# EasyEDA Pro project SimGEKI2_Core.epro, board Core New
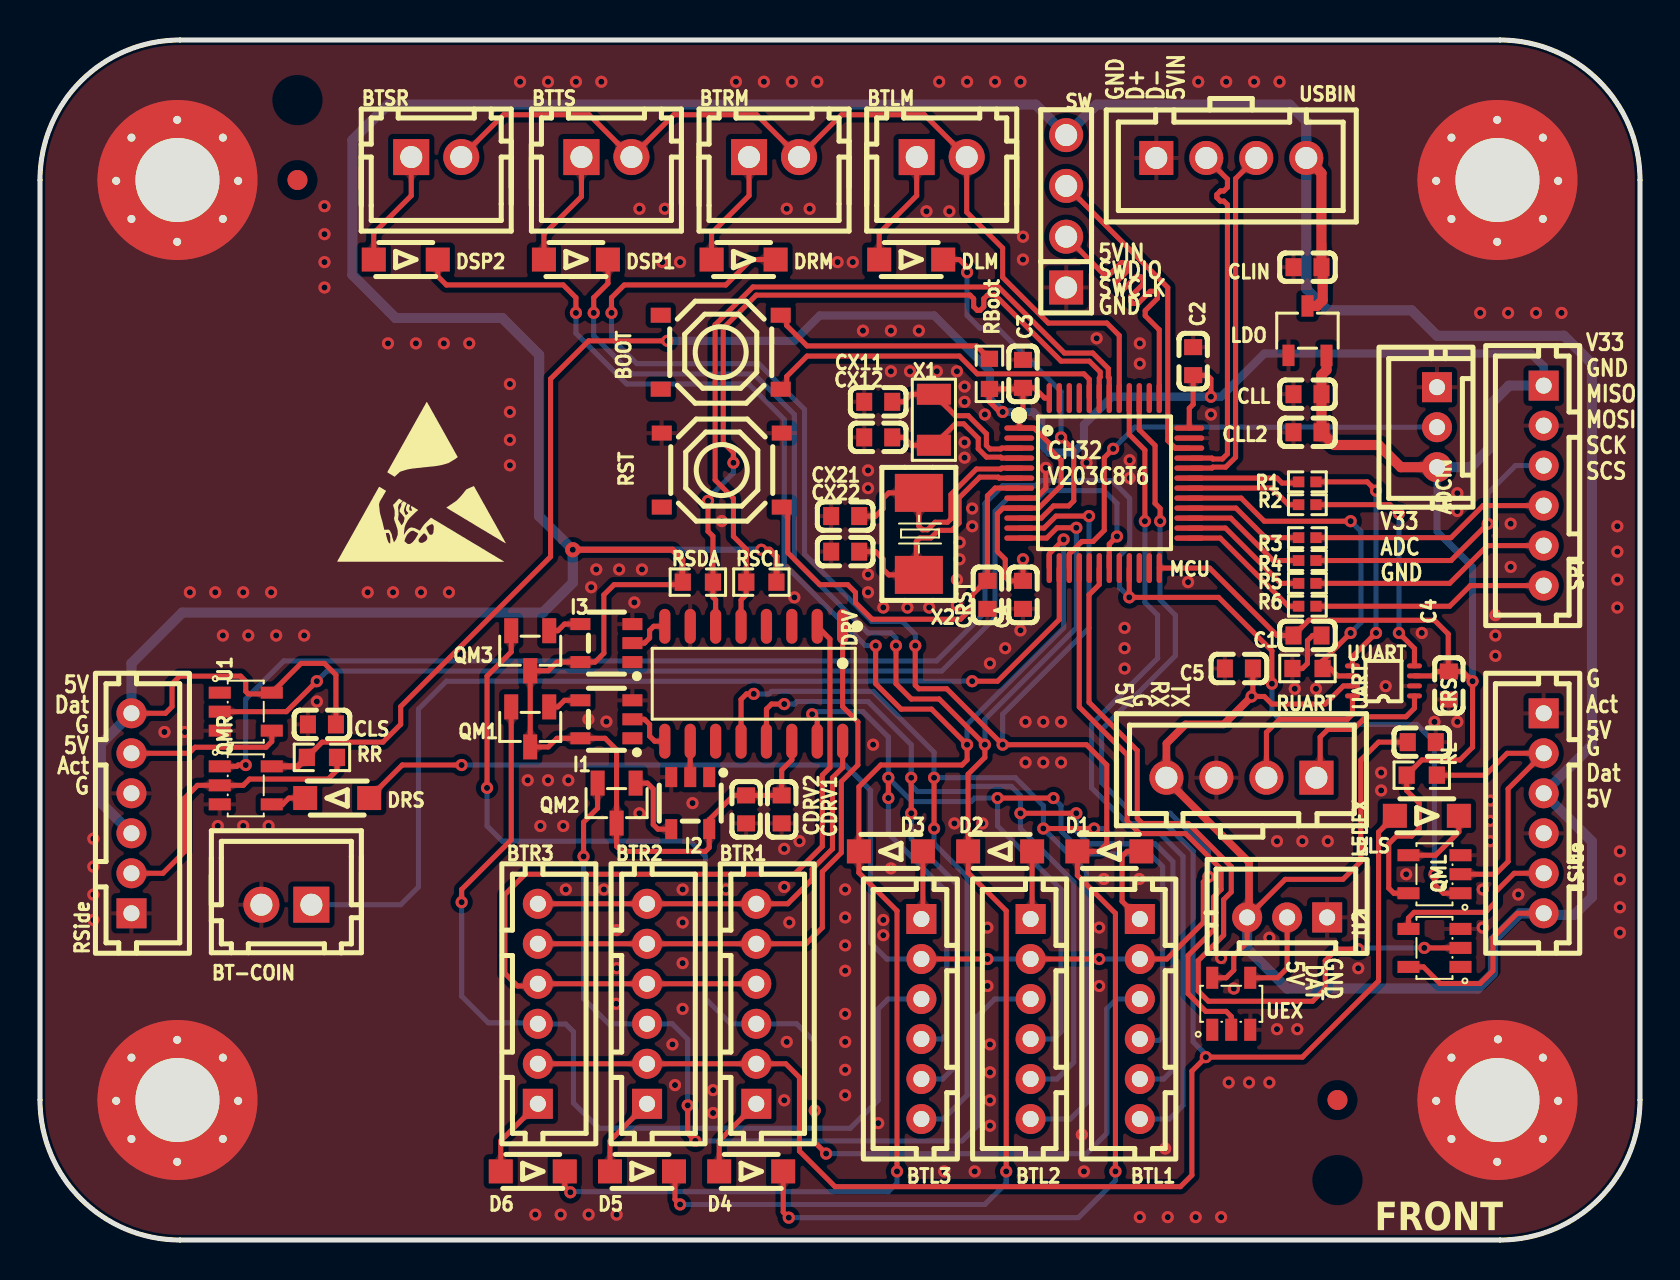
[diagram p1: board, top side]
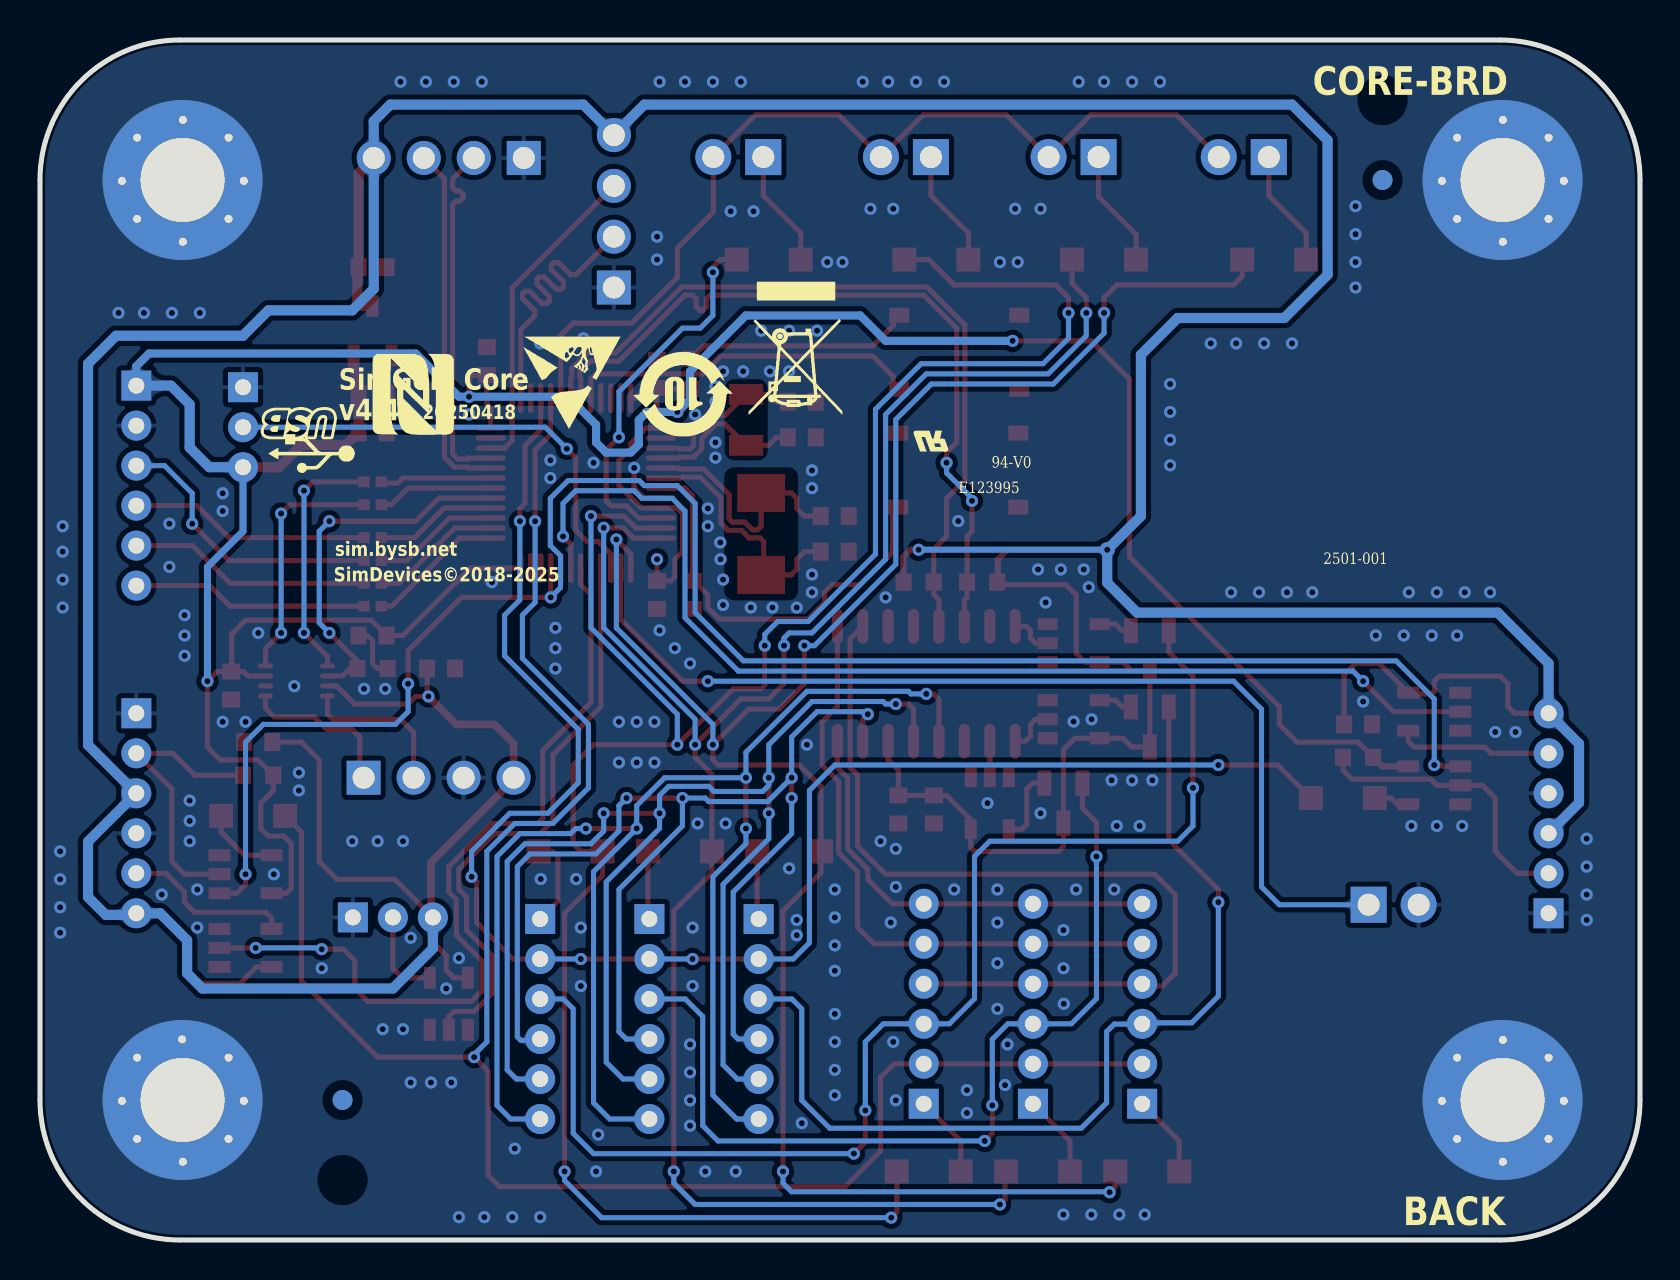
[diagram p2: board, bottom side, seen from below]

Outline 80 x 60 mm; copper layers: Top Layer, Bottom Layer. Coordinates in mm from the lower left corner of the outline.
Outline path: 0,53 0,7 arc(2.05,2.05) 7,0 73,0 arc(77.95,2.05) 80,7 80,53 arc(77.95,57.95) 73,60 7,60 arc(2.05,57.95) 0,53
Stack: Top Layer 0.035mm / Dielectric1 1.51mm FR4 er 4.5 / Bottom Layer 0.035mm

## Design rules (mm)
net D-: DP2
net D+: DP2
net SCL: DP5
net SDA: DP5
net OSC32_IN: DP1
net OSC32_OUT: DP1
net OSC_IN: DP4
net OSC_OUT: DP4
net SWDIO: DP3
net SWCLK: DP3
template: JLCPCB Capability(Two Layers Board)
spacing copperThickness1oz (default): track to track 0.102, other pairs 0.152 to 0.3
spacing copperThickness2oz: track to track 0.203, other pairs 0.152 to 0.3
track width copperThickness1oz (default): min 0.127, default 0.254, max 2.54
track width copperThickness2oz: min 0.203, default 0.254, max 2.54
differential pair differentialPair (default): width min 0.127, default 0.254, max 2.54; gap min 0.152, default 0.152
via viaSize (default): diameter min 0.5, default 0.61, max 10; hole min 0.3, default 0.305, max 6.3

## Placement (name value [footprint] x y rotation side)
ADCIN  HDGC2001WV-3P  [CONN-TH_3P-P2.00_HDGC2001WV-3P]  69.85 40.64 270 top
BOOT  TS-1187A-B-A-B  [SW-SMD_4P-L5.1-W5.1-P3.70-LS6.5-TL_H1.5]  34.04 44.39 180 top
BT-COIN  ZX-XH2.54-2PZZ  [CONN-TH_2P-P2.50_HX25003-2A]  12.32 16.76 180 top
BTL1  HDGC2001WV-6P  [CONN-TH_6P-P2.00_HDGC2001WV-6P]  54.99 11.05 270 top
BTL2  HDGC2001WV-6P  [CONN-TH_6P-P2.00_HDGC2001WV-6P]  49.53 11.05 270 top
BTL3  HDGC2001WV-6P  [CONN-TH_6P-P2.00_HDGC2001WV-6P]  44.07 11.05 270 top
BTLM  ZX-XH2.54-2PZZ  [CONN-TH_2P-P2.50_HX25003-2A]  45.09 54.15 0 top
BTR1  HDGC2001WV-6P  [CONN-TH_6P-P2.00_HDGC2001WV-6P]  35.81 11.81 90 top
BTR2  HDGC2001WV-6P  [CONN-TH_6P-P2.00_HDGC2001WV-6P]  30.35 11.81 90 top
BTR3  HDGC2001WV-6P  [CONN-TH_6P-P2.00_HDGC2001WV-6P]  24.89 11.81 90 top
BTRM  ZX-XH2.54-2PZZ  [CONN-TH_2P-P2.50_HX25003-2A]  36.7 54.15 0 top
BTSR  ZX-XH2.54-2PZZ  [CONN-TH_2P-P2.50_HX25003-2A]  19.81 54.15 0 top
BTTS  ZX-XH2.54-2PZZ  [CONN-TH_2P-P2.50_HX25003-2A]  28.32 54.15 0 top
C1  100nF  [C0603]  63.37 30.23 0 top
C2  100nF  [C0603]  57.66 43.94 90 top
C3  100nF  [C0603]  49.15 43.31 90 top
C4  100nF  [C0603]  70.44 27.72 270 top
C5  100nF  [C0603]  59.94 28.58 180 top
CA  100nF  [C0603]  49.15 32.26 90 top
CDRV1  2.2uF  [C0603]  37.08 21.53 270 top
CDRV2  100nF  [C0603]  35.31 21.53 270 top
CLIN  1uF  [C0603]  63.37 48.64 0 top
CLL  1uF  [C0603]  63.37 42.29 180 top
CLL2  100nF  [C0603]  63.37 40.39 180 top
CLS  100nF  [C0603]  14.1 25.78 180 top
CRS  100nF  [C0603]  69.09 24.89 0 top
CRST  100nF  [C0603]  47.37 32.26 90 top
CX11  15pF  [C0603]  41.91 41.91 0 top
CX12  15pF  [C0603]  41.91 40.13 0 top
CX21  22pF  [C0603]  40.26 36.2 0 top
CX22  22pF  [C0603]  40.26 34.42 0 top
D1  1N4148W  [SOD-123FL_L2.8-W1.8-LS3.7-RD_CC1884540]  53.47 19.43 0 top
D2  1N4148W  [SOD-123FL_L2.8-W1.8-LS3.7-RD_CC1884540]  48.01 19.43 0 top
D3  1N4148W  [SOD-123FL_L2.8-W1.8-LS3.7-RD_CC1884540]  42.54 19.43 0 top
D4  1N4148W  [SOD-123FL_L2.8-W1.8-LS3.7-RD_CC1884540]  35.56 3.43 180 top
D5  1N4148W  [SOD-123FL_L2.8-W1.8-LS3.7-RD_CC1884540]  30.1 3.43 180 top
D6  1N4148W  [SOD-123FL_L2.8-W1.8-LS3.7-RD_CC1884540]  24.64 3.43 180 top
DLM  1N4148W  [SOD-123FL_L2.8-W1.8-LS3.7-RD_CC1884540]  43.56 49.02 180 top
DLS  1N4148W  [SOD-123FL_L2.8-W1.8-LS3.7-RD_CC1884540]  69.34 21.21 180 top
DRM  1N4148W  [SOD-123FL_L2.8-W1.8-LS3.7-RD_CC1884540]  35.18 49.02 180 top
DRS  1N4148W  [SOD-123FL_L2.8-W1.8-LS3.7-RD_CC1884540]  14.86 22.1 0 top
DRV  CH422G  [SOP-16_L10.0-W3.9-P1.27-LS6.0-BL]  35.69 27.81 180 top
DSP1  1N4148W  [SOD-123FL_L2.8-W1.8-LS3.7-RD_CC1884540]  26.8 49.02 180 top
DSP2  1N4148W  [SOD-123FL_L2.8-W1.8-LS3.7-RD_CC1884540]  18.29 49.02 180 top
I1  SN74LVC1G14DBVR  [SOT-23-5_L3.0-W1.7-P0.95-LS2.8-BR]  28.32 26.03 0 top
I2  SN74LVC1G14DBVR  [SOT-23-5_L3.0-W1.7-P0.95-LS2.8-BR]  32.51 21.84 90 top
I3  SN74LVC1G14DBVR  [SOT-23-5_L3.0-W1.7-P0.95-LS2.8-BR]  28.32 29.84 0 top
LDO  XC6206P332MR-G  [SOT-23-3_L2.9-W1.6-P1.90-LS2.8-BR]  63.37 45.47 270 top
LEDEX  HDGC2001WV-3P  [CONN-TH_3P-P2.00_HDGC2001WV-3P]  62.36 16.13 180 top
LSide  HDGC2001WV-6P  [CONN-TH_6P-P2.00_HDGC2001WV-6P]  75.18 21.34 270 top
MCU  CH32V203C8T6  [LQFP-48_L7.0-W7.0-P0.50-LS9.0-BL]  53.21 37.85 270 top
NOREF  -  [Pad_e3311]  75.14 9.12 0 top
NOREF#2  -  [Pad_e3320]  72.86 56.01 0 top
NOREF#3  -  [Pad_e3309]  75.14 5.05 0 top
NOREF#4  -  [Pad_e3290]  9.14 55.12 0 top
NOREF#5  -  [Pad_e3306]  69.81 6.96 0 top
NOREF#6  -  [Pad_e3295]  3.81 52.96 0 top
NOREF#7  -  [Pad_e3294]  4.57 51.05 0 top
NOREF#8  -  [Pad_e3291]  9.91 52.96 0 top
NOREF#9  -  [Pad_e3317]  75.14 51.05 0 top
NOREF#10  -  [Pad_e3292]  6.86 49.91 0 top
NOREF#11  -  [Pad_e3303]  9.14 9.12 0 top
NOREF#12  -  [Pad_e3300]  6.86 3.91 0 top
NOREF#13  -  [Pad_e3310]  75.91 6.96 0 top
NOREF#14  -  [Pad_e2621]  6.87 7 0 top
NOREF#15  -  [Pad_e3297]  4.57 9.12 0 top
NOREF#16  -  [Pad_e1]  64.87 7 0 top
NOREF#17  -  [Pad_e3319]  75.14 55.12 0 top
NOREF#18  -  [Pad_e267]  12.87 53 0 top
NOREF#19  -  [Pad_e3315]  70.57 51.05 0 top
NOREF#20  -  [Pad_e545]  12.87 53 0 top
NOREF#21  -  [Pad_e3305]  70.57 9.12 0 top
NOREF#22  -  [Pad_e3302]  9.91 6.96 0 top
NOREF#23  -  [Pad_e3318]  75.91 52.96 0 top
NOREF#24  -  [Pad_e3316]  72.86 49.91 0 top
NOREF#25  -  [Pad_e3304]  6.86 10.01 0 top
NOREF#26  -  [Pad_e3308]  72.86 3.91 0 top
NOREF#27  -  [Pad_e3296]  4.57 55.12 0 top
NOREF#28  -  [Pad_e3313]  70.57 55.12 0 top
NOREF#29  -  [Pad_e3307]  70.57 5.05 0 top
NOREF#30  -  [Pad_e3293]  9.14 51.05 0 top
NOREF#31  -  [Pad_e3288]  6.86 56.01 0 top
NOREF#32  -  [Pad_e3312]  72.9 10.03 0 top
NOREF#33  -  [Pad_e3015]  72.87 7 0 top
NOREF#34  -  [Pad_e3301]  9.14 5.05 0 top
NOREF#35  -  [Pad_e3299]  4.57 5.05 0 top
NOREF#36  -  [Pad_e2813]  6.87 53 0 top
NOREF#37  -  [Pad_e544]  64.87 7 0 top
NOREF#38  -  [Pad_e3314]  69.81 52.96 0 top
NOREF#39  -  [Pad_e3298]  3.81 6.96 0 top
NOREF#40  -  [Pad_e3016]  72.87 53 0 top
QM1  AO3400A  [SOT-23-3_L2.9-W1.3-P1.90-LS2.4-BR]  24.51 25.65 90 top
QM2  AO3400A  [SOT-23-3_L2.9-W1.3-P1.90-LS2.4-BR]  28.83 21.84 90 top
QM3  AO3400A  [SOT-23-3_L2.9-W1.3-P1.90-LS2.4-BR]  24.51 29.46 90 top
QML  SN74LVC1G125DBVR  [SOT-23-5_L3.0-W1.7-P0.95-LS2.8-BR#2]  69.72 18.29 0 top
QMR  SN74LVC1G125DBVR  [SOT-23-5_L3.0-W1.7-P0.95-LS2.8-BR#2]  10.29 22.73 180 top
R1  33  [R0402]  63.37 37.91 0 top
R2  33  [R0402]  63.37 36.77 0 top
R3  33  [R0402]  63.37 35.12 0 top
R4  33  [R0402]  63.37 33.97 0 top
R5  33  [R0402]  63.37 32.83 0 top
R6  33  [R0402]  63.37 31.69 0 top
RBoot  4.7K  [R0603]  47.47 43.31 90 top
RL  15K  [R0603]  69.09 23.24 180 top
RR  15K  [R0603]  14.1 24.13 180 top
RSCL  4.7K  [R0603]  36.07 32.89 0 top
RSDA  4.7K  [R0603]  32.89 32.89 180 top
RSide  HDGC2001WV-6P  [CONN-TH_6P-P2.00_HDGC2001WV-6P]  4.57 21.34 90 top
RST  TS-1187A-B-A-B  [SW-SMD_4P-L5.1-W5.1-P3.70-LS6.5-TL_H1.5]  34.09 38.5 180 top
RUART  15K  [R0603]  63.37 28.58 0 top
SPI  HDGC2001WV-6P  [CONN-TH_6P-P2.00_HDGC2001WV-6P]  75.18 37.72 270 top
SW  PZ254V-11-04P  [HDR-TH_4P-P2.54-V-M]  51.31 51.44 90 top
U1  SN74LVC1G17DBVR  [SOT-23-5_L3.0-W1.7-P0.95-LS2.8-BR#2]  10.29 26.42 180 top
U2  SN74LVC1G17DBVR  [SOT-23-5_L3.0-W1.7-P0.95-LS2.8-BR#2]  69.72 14.61 0 top
UART  2.54-4P ZZDK  [HDR-TH_4P-P2.50-V-F-2]  60.07 23.11 180 top
UEX  SN74LVC1G17DBVR  [SOT-23-5_L3.0-W1.7-P0.95-LS2.8-BR#2]  59.56 11.81 270 top
USBIN  2.54-4P ZZDK  [HDR-TH_4P-P2.50-V-F-2]  59.56 54.1 0 top
UUART  TXS0102DCUR  [VSSOP-8_L2.4-W2.1-P0.50-LS3.2-BR]  67.17 27.95 0 top
X1  32.768kHz  [CRYSTAL-SMD_L3.2-W1.5-1]  44.69 41.01 90 top
X2  8MHz  [CRYSTAL-SMD_L5.0-W3.2]  43.94 35.31 90 top

## Footprints (pads in the part's own frame, mm; a bottom-side part is the same pattern mirrored in y, then rotated)
C0603
  rect 0.8x0.9 smd: 1(-0.7,0) 2(0.7,0)
CONN-TH_2P-P2.50_HX25003-2A
  rect 1.8x1.8 hole 1.1: 1(-1.25,0)
  round 1.8 hole 1.1: 2(1.25,0)
CONN-TH_3P-P2.00_HDGC2001WV-3P
  rect 1.5x1.5 hole 0.8: 1(-2,0)
  round 1.5 hole 0.8: 2(0,0) 3(2,0)
CONN-TH_6P-P2.00_HDGC2001WV-6P
  rect 1.5x1.5 hole 0.8: 1(-5,0)
  round 1.5 hole 0.8: 2(-3,0) 3(-1,0) 4(1,0) 5(3,0) 6(5,0)
CRYSTAL-SMD_L3.2-W1.5-1
  rect 1.05x1.7 smd: 1(-1.275,0) 2(1.275,0)
CRYSTAL-SMD_L5.0-W3.2
  rect 1.9x2.4 smd: 1(-2.05,0) 2(2.05,0)
HDR-TH_4P-P2.50-V-F-2
  rect 1.7x1.7 hole 1.1: 1(-3.75,0)
  round 1.7 hole 1.1: 2(-1.25,0) 3(1.25,0) 4(3.75,0)
HDR-TH_4P-P2.54-V-M
  rect 1.7x1.7 hole 1.1: 1(-3.81,0)
  round 1.7 hole 1.1: 2(-1.27,0) 3(1.27,0) 4(3.81,0)
LQFP-48_L7.0-W7.0-P0.50-LS9.0-BL
  oval 0.27x1.5 smd: 1(-2.75,-4.25) 2(-2.25,-4.25) 3(-1.75,-4.25) 4(-1.25,-4.25) 5(-0.75,-4.25) 6(-0.25,-4.25) 7(0.25,-4.25) 8(0.75,-4.25) 9(1.25,-4.25) 10(1.75,-4.25) 11(2.25,-4.25) 12(2.75,-4.25) 25(2.75,4.25) 26(2.25,4.25) 27(1.75,4.25) 28(1.25,4.25) 29(0.75,4.25) 30(0.25,4.25) 31(-0.25,4.25) 32(-0.75,4.25) 33(-1.25,4.25) 34(-1.75,4.25) 35(-2.25,4.25) 36(-2.75,4.25)
  oval 1.5x0.27 smd: 13(4.25,-2.75) 14(4.25,-2.25) 15(4.25,-1.75) 16(4.25,-1.25) 17(4.25,-0.75) 18(4.25,-0.25) 19(4.25,0.25) 20(4.25,0.75) 21(4.25,1.25) 22(4.25,1.75) 23(4.25,2.25) 24(4.25,2.75) 37(-4.25,2.75) 38(-4.25,2.25) 39(-4.25,1.75) 40(-4.25,1.25) 41(-4.25,0.75) 42(-4.25,0.25) 43(-4.25,-0.25) 44(-4.25,-0.75) 45(-4.25,-1.25) 46(-4.25,-1.75) 47(-4.25,-2.25) 48(-4.25,-2.75)
Pad_e1
  round 1 smd: 49(0,0)
Pad_e267
  round 1 smd: 49(0,0)
Pad_e544
  round 1 smd far side: 49(0,0)
Pad_e545
  round 1 smd far side: 49(0,0)
Pad_e2621
  round 8 hole 4.2: 21(0,0)
Pad_e2813
  round 8 hole 4.2: 21(0,0)
Pad_e3015
  round 8 hole 4.2: 21(0,0)
Pad_e3016
  round 8 hole 4.2: 21(0,0)
Pad_e3288
  round 0.7 hole 0.4: 1(0,0)
Pad_e3290
  round 0.7 hole 0.4: 1(0,0)
Pad_e3291
  round 0.7 hole 0.4: 1(0,0)
Pad_e3292
  round 0.7 hole 0.4: 1(0,0)
Pad_e3293
  round 0.7 hole 0.4: 1(0,0)
Pad_e3294
  round 0.7 hole 0.4: 1(0,0)
Pad_e3295
  round 0.7 hole 0.4: 1(0,0)
Pad_e3296
  round 0.7 hole 0.4: 1(0,0)
Pad_e3297
  round 0.7 hole 0.4: 1(0,0)
Pad_e3298
  round 0.7 hole 0.4: 1(0,0)
Pad_e3299
  round 0.7 hole 0.4: 1(0,0)
Pad_e3300
  round 0.7 hole 0.4: 1(0,0)
Pad_e3301
  round 0.7 hole 0.4: 1(0,0)
Pad_e3302
  round 0.7 hole 0.4: 1(0,0)
Pad_e3303
  round 0.7 hole 0.4: 1(0,0)
Pad_e3304
  round 0.7 hole 0.4: 1(0,0)
Pad_e3305
  round 0.7 hole 0.4: 1(0,0)
Pad_e3306
  round 0.7 hole 0.4: 1(0,0)
Pad_e3307
  round 0.7 hole 0.4: 1(0,0)
Pad_e3308
  round 0.7 hole 0.4: 1(0,0)
Pad_e3309
  round 0.7 hole 0.4: 1(0,0)
Pad_e3310
  round 0.7 hole 0.4: 1(0,0)
Pad_e3311
  round 0.7 hole 0.4: 1(0,0)
Pad_e3312
  round 0.7 hole 0.4: 1(0,0)
Pad_e3313
  round 0.7 hole 0.4: 1(0,0)
Pad_e3314
  round 0.7 hole 0.4: 1(0,0)
Pad_e3315
  round 0.7 hole 0.4: 1(0,0)
Pad_e3316
  round 0.7 hole 0.4: 1(0,0)
Pad_e3317
  round 0.7 hole 0.4: 1(0,0)
Pad_e3318
  round 0.7 hole 0.4: 1(0,0)
Pad_e3319
  round 0.7 hole 0.4: 1(0,0)
Pad_e3320
  round 0.7 hole 0.4: 1(0,0)
R0402
  rect 0.566x0.54 smd: 1(-0.433,0) 2(0.433,0)
R0603
  rect 0.806x0.864 smd: 1(-0.753,0) 2(0.753,0)
SOD-123FL_L2.8-W1.8-LS3.7-RD_CC1884540
  rect 1.2x1.2 smd: 1(-1.6,0) 2(1.6,0)
SOP-16_L10.0-W3.9-P1.27-LS6.0-BL
  oval 0.56x1.745 smd: 1(-4.445,-2.873) 2(-3.175,-2.873) 3(-1.905,-2.873) 4(-0.635,-2.873) 5(0.635,-2.873) 6(1.905,-2.873) 7(3.175,-2.873) 8(4.445,-2.873) 9(4.445,2.873) 10(3.175,2.873) 11(1.905,2.873) 12(0.635,2.873) 13(-0.635,2.873) 14(-1.905,2.873) 15(-3.175,2.873) 16(-4.445,2.873)
SOT-23-3_L2.9-W1.3-P1.90-LS2.4-BR
  rect 1.25x0.7 smd: 1(1,-0.95) 2(1,0.95) 3(-1,0)
SOT-23-3_L2.9-W1.6-P1.90-LS2.8-BR
  rect 1.07x0.6 smd: 1(1.235,-0.95) 2(1.235,0.95) 3(-1.235,0)
SOT-23-5_L3.0-W1.7-P0.95-LS2.8-BR
  rect 1x0.6 smd: 1(1.3,-0.95) 2(1.3,0) 3(1.3,0.95) 4(-1.3,0.95) 5(-1.3,-0.95)
SOT-23-5_L3.0-W1.7-P0.95-LS2.8-BR#2
  rect 1.1x0.6 smd: 1(1.3,-0.95) 2(1.3,0) 3(1.3,0.95) 4(-1.3,0.95) 5(-1.3,-0.95)
SW-SMD_4P-L5.1-W5.1-P3.70-LS6.5-TL_H1.5
  rect 1x0.75 smd: 1(-3,1.85) 2(3,1.85) 3(-3,-1.85) 4(3,-1.85)
VSSOP-8_L2.4-W2.1-P0.50-LS3.2-BR
  oval 0.75x0.25 smd: 1(1.55,-0.75) 2(1.55,-0.25) 3(1.55,0.25) 4(1.55,0.75) 5(-1.55,0.75) 6(-1.55,0.25) 7(-1.55,-0.25) 8(-1.55,-0.75)

## Nets
As in the schematic, except:
GND: ADCIN.1 BT-COIN.2 C1.2 C2.2 C3.2 C4.2 C5.2 CA.1 CDRV1.2 CDRV2.2 CLIN.1 CLL.2 CLL2.2 CLS.2 CRS.2 CRST.1 CX11.1 CX12.1 CX21.1 CX22.1 DRV.7 I1.3 I2.3 I3.3 LDO.1 LEDEX.1 LSide.1 LSide.4 MCU.8 MCU.23 MCU.35 MCU.47 NOREF.1 NOREF#2.1 NOREF#3.1 NOREF#4.1 NOREF#5.1 NOREF#6.1 NOREF#7.1 NOREF#8.1 NOREF#9.1 NOREF#10.1 NOREF#11.1 NOREF#12.1 NOREF#13.1 NOREF#14.21 NOREF#15.1 NOREF#17.1 NOREF#19.1 NOREF#21.1 NOREF#22.1 NOREF#23.1 NOREF#24.1 NOREF#25.1 NOREF#26.1 NOREF#27.1 NOREF#28.1 NOREF#29.1 NOREF#30.1 NOREF#31.1 NOREF#32.1 NOREF#33.21 NOREF#34.1 NOREF#35.1 NOREF#36.21 NOREF#38.1 NOREF#39.1 NOREF#40.21 QML.3 QMR.3 RSide.1 RSide.4 RST.3 RST.4 RUART.1 SPI.2 SW.1 U1.3 U2.3 UART.3 UEX.3 USBIN.1 UUART.2

Pads without a net: BOOT 2 4; DRV 3 4 11; I1 1; I2 1; I3 1; MCU 2 17 20 22 38 45 46; NOREF#16 49; NOREF#18 49; NOREF#20 49; NOREF#37 49; RST 2; U1 1; U2 1; UEX 1

## Via types
v1: diameter 0.61, hole 0.305, Top Layer to Bottom Layer, 303 vias
v2: diameter 0.762, hole 0.305, Top Layer to Bottom Layer, 1 via

## Routing (per net, layer and track width the routed paths; a pad name or vN(x,y) marks a point on that pad's centre or on a via; arc(x,y) is an arc through that point)
GND: length 5.4
  Top Layer w0.254: v1(50.29,38.61) 50.29,37.59 49.8,37.1 MCU.8 ; C1.2 63.63,30.23 63.37,29.97 63.37,28.83 63.12,28.58 RUART.1
  vias: v1(2.67,20.07) v1(2.67,18.67) v1(2.67,17.27) v1(2.67,16) v1(6.22,25.4) v1(7.24,25.4) v1(7.49,32.39) v1(8.76,32.39) v1(8.89,20.7) v1(9.14,30.23) v1(10.16,32.39) v1(10.16,20.7) v1(10.41,30.23) v1(11.43,20.7) v1(11.56,32.39) v1(11.81,30.23) v1(13.21,30.23) v1(13.84,26.92) v1(14.22,51.69) v1(14.22,50.29) v1(14.22,48.89) v1(14.22,47.62) v1(16.38,32.39) v1(17.4,44.83) v1(17.65,32.39) v1(18.8,44.83) v1(19.05,32.39) v1(20.19,44.83) v1(20.45,32.39) v1(21.46,44.83) v1(23.5,42.8) v1(23.5,41.4) v1(23.5,40) v1(23.5,38.73) v1(24,57.91) v1(24.38,22.99) v1(24.76,1.27) v1(25.02,20.7) v1(25.4,57.91) v1(25.4,22.99) v1(26.03,1.27) v1(26.16,20.7) v1(26.29,17.53) v1(26.42,22.99) v1(26.8,57.91) v1(27.42,26.03) v1(27.43,1.27) v1(27.56,32.64) v1(27.81,33.53) v1(28.07,57.91) v1(28.19,17.53) v1(28.32,25.92) v1(28.83,15.49) v1(28.83,13.59) v1(28.81,11.81) v1(28.83,1.27) v1(28.96,33.53) v1(29.72,31.88) v1(29.97,51.56) v1(29.97,21.34) v1(30.1,33.53) v1(31.12,48.89) v1(31.24,51.56) v1(31.62,9.78) v1(31.75,7.75) v1(32,48.89) v1(32.13,17.53) v1(32.13,15.88) v1(32.13,13.84) v1(32.13,11.56) v1(32.63,21.84) v1(33.66,7.49) v1(33.66,6.35) v1(34.09,35.95) v1(34.29,17.53) v1(34.8,57.91) v1(36.19,57.91) v1(37.21,19.56) v1(37.21,17.65) v1(37.21,6.99) v1(37.34,51.56) v1(37.34,9.91) v1(37.47,15.88) v1(37.59,57.91) v1(37.72,32.13) v1(37.97,19.94) v1(38.48,51.56) v1(38.86,57.91) v1(39.88,48.89) v1(40.26,17.53) v1(40.26,16.13) v1(40.26,14.73) v1(40.26,13.46) v1(40.26,11.3) v1(40.26,9.91) v1(40.26,8.51) v1(40.26,7.24) v1(40.64,48.89) v1(41.15,45.47) v1(41.4,38.48) v1(41.4,37.59) v1(41.4,33.27) v1(41.4,32.39) v1(41.66,24.77) v1(41.91,5.84) v1(42.16,31.62) v1(42.16,16) v1(42.16,15.24) v1(42.54,45.47) v1(42.54,43.43) v1(42.54,18.58) v1(43.37,31.62) v1(43.5,43.43) v1(43.94,45.47) v1(44.32,51.44) v1(44.46,31.62) v1(44.84,43.43) v1(44.96,57.91) v1(45.21,3.43) v1(45.47,51.44) v1(45.72,20.83) v1(45.85,43.43) v1(45.85,33.02) v1(45.85,31.75) v1(45.99,34.88) v1(45.97,34.04) v1(46.23,42.67) v1(46.23,41.91) v1(46.23,39.88) v1(46.23,39.12) v1(46.35,57.91) v1(46.61,36.58) v1(46.61,35.69) v1(46.74,3.43) v1(47.12,20.83) v1(47.24,41.28) v1(47.37,15.62) v1(47.37,12.7) v1(47.5,28.83) v1(47.5,9.78) v1(47.5,8.38) v1(47.5,6.99) v1(47.5,5.72) v1(47.75,57.91) v1(48.26,29.59) v1(49.02,57.91) v1(49.02,30.48) v1(49.15,50.17) v1(49.15,49.02) v1(49.28,25.91) v1(49.28,23.88) v1(50.16,25.91) v1(50.16,23.88) v1(51.05,25.91) v1(51.05,23.88) v1(52.09,5.27) v1(52.2,3.43) v1(52.32,38.86) v1(52.83,45.09) v1(52.96,15.62) v1(52.96,12.7) v1(53.19,18.05) v1(54.23,30.61) v1(54.23,29.59) v1(54.23,28.58) v1(54.48,38.99) v1(54.48,38.1) v1(54.99,44.83) v1(54.99,43.81) v1(54.96,18.05) v1(54.99,1.14) v1(56.26,4.57) v1(56.39,1.14) v1(57.4,32.89) v1(57.78,1.14) v1(57.91,57.91) v1(58.55,41.28) v1(59.06,14.1) v1(59.06,1.14) v1(59.31,57.91) v1(59.44,7.87) v1(59.69,12.57) v1(60.45,7.87) v1(60.71,57.91) v1(61.47,15.11) v1(61.47,7.87) v1(61.85,19.94) v1(61.85,10.54) v1(61.98,57.91) v1(62.74,27.56) v1(62.87,10.54) v1(63.12,19.94) v1(63.8,27.56) v1(64.39,19.94) v1(65.91,13.59) v1(67.06,23.37) v1(67.06,22.48) v1(67.28,27.69) v1(68.31,18.29) v1(69.09,30.35) v1(69.72,25.91) v1(70.87,37.34) v1(70.87,36.45) v1(70.87,25.91) v1(72.01,46.36) v1(72.14,17.53) v1(72.14,15.62) v1(72.52,21.97) v1(72.52,20.95) v1(72.52,19.94) v1(72.77,31.24) v1(72.77,30.23) v1(72.77,29.21) v1(73.41,46.36) v1(73.53,35.81) v1(73.53,33.66) v1(73.91,17.27) v1(74.8,46.36) v1(76.07,46.36) v1(78.87,35.69) v1(78.87,34.42) v1(78.87,33.02) v1(78.87,31.62) v1(78.99,19.43) v1(78.99,18.03) v1(78.99,16.64) v1(78.99,15.37)
V33: length 178.5
  Top Layer w0.254: MCU.24 58.48,33.6 61.85,30.23 C1.1 63.44,30.99 69.72,30.99 70.41,30.3 70.41,28.46 C4.1 ; C4.1 71.14,28.42 v1(71.63,27.94) 71.63,24.64 70.99,24 69.1,24 RL.2 68.33,22.47 68.96,21.84 68.96,20.57 68.58,20.19 67.82,20.19 67.44,19.81 67.44,17.59 67.69,17.34 68.42,17.34 ; C4.1 69.83,28.42 69.61,28.2 UUART.3 ; MCU.36 57.46,41.59 57.66,41.78 C2.1 57.67,43.23 58.37,43.23 58.55,43.05 v1(58.55,42.16) ; v1(48.13,41.4) 47.98,41.4 47.47,41.91 RBoot.1 49.1,42.55 C3.1 ; v1(49.15,34.04) CA.2 48.45,32.96 48.26,33.15 48.26,34.04 47.87,34.43 47.87,36.31 48.15,36.6 MCU.9 49.93,36.6 51.05,37.72 51.05,38.99 50.47,39.57 50.47,39.83 49.7,40.6 MCU.1 48.96,41.34 49.15,41.53 C3.1 ; v1(31.37,44.96) 27.43,44.96 25.53,43.05 25.53,34.16 18.03,26.67 18.03,25.78 17.14,24.89 14.11,24.89 RR.2 ; C3.1 49.72,42.61 50.23,42.1 MCU.48
  Top Layer w0.305: QMR.5 12.9,23.68 RR.2
  Top Layer w0.508: 64.32,44.23 64.32,43.5 64.07,43.25 CLL.1 CLL2.1 64.71,39.75 66.93,39.75 68.04,38.64 ADCIN.3
  Bottom Layer w0.35: ADCIN.3 69.85,35.43 71.63,33.66 v1(71.63,27.94)
  Bottom Layer w0.406: v1(31.37,44.96) 37.72,44.96 38.99,46.23 44.7,46.23 47.5,43.43 47.5,42.04 v1(48.13,41.4) 49.66,41.4 50.06,41 50.06,39.78 50.47,39.37 51.69,39.37 52.2,39.88 52.2,40.77 53.59,42.16 v1(58.55,42.16) 59.06,42.16 61.21,44.32 74.55,44.32 75.18,43.69 SPI.1
  Bottom Layer w0.508: SPI.1 73.45,42.72 72.52,41.78 72.52,39.62 71.53,38.64 ADCIN.3
VCC: length 319.9
  Top Layer w0.254: UUART.7 65.17,27.7 64.26,26.8 61.59,26.8 61.21,27.18 v1(60.58,27.18) 60.64,27.24 C5.1 ; CLS.1 14.8,28.26 14.22,28.83 13.05,28.83 U1.5 11.53,27.31 10.41,27.31 10.29,27.43 10.29,27.94 10.03,28.19 6.98,28.19 6.6,27.81 6.6,26.67 6.27,26.34 RSide.6 ; LSide.6 73.87,16.34 72.64,15.11 72.64,13.46 72.01,12.83 70,12.83 69.17,13.66 68.42,13.66 ; DRV.14 37.59,24 37.08,23.5 CDRV1.1 CDRV2.1 34.67,22.23 33.46,21.02 I2.5 33.46,19.62 33.27,19.43 29.08,19.43 28.83,19.69 QM2.3 28.83,24.51 28.25,25.09 I1.5 25.85,25.09 25.42,24.65 QM1.3 QM3.3 25.42,28.46 25.85,28.89 I3.5 27.75,28.89 28.19,29.34 28.19,32.26 28.7,32.77 32.01,32.77 RSDA.2 ; 60.45,16.22 62.26,18.03 65.15,18.03 66.04,18.92 66.04,24 66.93,24.89 CRS.1 ; UEX.5 59.31,13.11 59.69,13.49 59.69,14.22 60.36,14.89 LEDEX.3
  Top Layer w0.305: RSDA.2 32.12,32.92 32.12,34.02 31.62,34.51 v2(26.64,34.51) ; v1(36.07,34.51) 36.48,34.51 36.83,34.16 36.83,32.9 RSCL.2
  Top Layer w0.381: v1(60.58,27.18) 59.18,25.78 57.28,25.78 56.32,24.83 UART.4 56.32,23.02 60.45,18.89 60.45,16.22 LEDEX.3
  Top Layer w0.508: USBIN.4 64.07,53.34 CLIN.2 64.13,48.58 64.13,46.99 63.85,46.7 LDO.3
  Bottom Layer w0.305: v2(26.64,34.51) v1(36.07,34.51)
  Bottom Layer w0.508: LEDEX.3 60.36,14.57 62.36,12.57 71.88,12.57 72.64,13.34 72.64,14.99 73.99,16.34 LSide.6 75.26,16.26 76.71,16.26 77.6,17.14 77.6,19.92 LSide.3 77.6,24.75 77.6,43.81 76.2,45.21 69.85,45.21 68.58,46.48 64.39,46.48 63.31,47.56 USBIN.4 63.31,55.94 62.48,56.77 52.83,56.77 SW.4 49.78,56.77 17.4,56.77 15.62,54.99 15.62,48.26 17.78,46.1 23.11,46.1 24.96,44.26 24.96,36.2 v2(26.64,34.51) 26.64,32.86 25.15,31.37 7.11,31.37 4.57,28.83 RSide.6 3.05,24.81 3.05,21.86 RSide.3
ADC: length 23.8
  Top Layer w0.254: v1(53.66,39.56) 53.21,39.12 53.21,35.49 52.65,34.92 52.09,34.92 51.46,34.3 MCU.15
  Bottom Layer w0.254: ADCIN.2 54.74,40.64 v1(53.66,39.56)
BOOT0: length 17.6
  Top Layer w0.254: 37.34,42.54 37.34,43.18 38.35,44.2 45.97,44.2 46.86,43.31 52.2,43.31 52.46,43.04 MCU.44
COIN: length 51.1
  Top Layer w0.254: v1(46.61,27.94) 47.88,27.94 50.96,31.02 MCU.14
  Bottom Layer w0.254: v1(46.61,27.94) 20.32,27.94 18.92,26.54 18.92,17.65 18.03,16.76 BT-COIN.1
COL1: length 83.6
  Top Layer w0.254: v1(58.42,18.16) 58.17,17.91 58.17,15.88 56.34,14.05 BTL1.2 ; DRS.2 18.11,23.75 v1(21.08,23.75) ; v1(56.01,35.94) 56.01,36.58 55.75,36.83 55.75,39.72 54.96,40.51 MCU.39 ; BTL3.2 v1(47.37,14.05) ; BTL2.2 v1(52.96,14.05)
  Bottom Layer w0.254: v1(58.42,18.16) 58.42,19.43 56.51,21.34 54.61,21.34 53.09,22.86 53.09,25.53 56.77,29.21 56.77,31.24 56.01,32 v1(56.01,35.94) ; v1(47.37,14.05) BTL2.2 ; v1(21.08,23.75) 40.26,23.75 41.53,22.48 41.53,14.86 42.34,14.05 BTL3.2 ; v1(52.96,14.05) BTL1.2
COL2: length 101
  Top Layer w0.254: DLS.2 66.93,20.4 66.93,12.95 63.12,9.14 v1(58.29,9.14) 57.59,8.45 57.59,3.24 57.02,2.67 39.75,2.67 37.97,4.44 37.97,8.13 37.29,8.81 BTR1.2 BTR2.2 BTR3.2 ; v1(55.25,35.94) 55.25,39.5 54.46,40.28 MCU.40
  Bottom Layer w0.254: v1(58.29,9.14) 58.29,9.27 57.66,9.91 57.66,19.43 56.26,20.83 54.36,20.83 52.58,22.61 52.58,25.78 55.88,29.08 55.88,31.24 55.25,31.88 v1(55.25,35.94)
COL3: length 47.5
  Top Layer w0.254: BTSR.2 23.18,56.26 27.46,56.26 BTTS.2 31.69,56.26 35.84,56.26 BTRM.2 40.07,56.26 44.22,56.26 BTLM.2 46.34,51.39 48.13,49.59 48.13,48.13 50.42,45.85 53.34,45.85 53.96,45.22 MCU.41
D+: length 17.8
  Top Layer w0.254: USBIN.2 59.37,53.04 59.37,52.63 59.19,52.45 59.02,52.45 58.84,52.27 58.84,52.12 59.02,51.94 59.19,51.94 59.37,51.76 59.37,39.31 59.12,39.05 58.64,39.05 58.59,39.1 57.59,39.1
D-: length 17.8
  Top Layer w0.254: USBIN.3 59.78,53.07 59.78,39.14 59.28,38.64 58.64,38.64 58.59,38.6 57.59,38.6
LED-B1: length 81.2
  Top Layer w0.254: DRV.12 35.05,27.03 35.33,27.31 v1(35.69,27.31) ; v1(50.16,20.57) v1(52.7,20.57) ; v1(44.7,23.11) v1(44.7,20.57)
  Bottom Layer w0.254: v1(44.7,20.57) 44.7,19.81 46.35,18.16 46.35,7.24 45.16,6.05 BTL3.6 ; BTL2.6 51.51,6.05 52.32,6.86 52.32,18.42 v1(50.16,20.57) 50.16,21.72 48.77,23.11 v1(44.7,23.11) 44.7,24.38 41.66,27.43 36.58,27.43 36.45,27.31 v1(35.69,27.31) ; BTL1.6 56.47,6.05 57.15,6.73 57.15,19.18 56.01,20.32 53.47,20.32 53.21,20.57 v1(52.7,20.57)
LED-B2: length 21.8
  Top Layer w0.254: DRV.16 40.13,23.62 39.62,23.11 39.62,19.56 38.61,18.54 38.61,18.03 37.38,16.81 BTR1.6 BTR2.6 BTR3.6
LED-G1: length 73.5
  Top Layer w0.254: DRV.13 36.32,26.54 36.58,26.8 v1(37.21,26.8) ; v1(43.56,23.11) v1(43.56,21.34) ; v1(49.02,21.34) v1(51.82,21.34)
  Bottom Layer w0.254: BTL1.5 56.18,8.05 56.64,8.51 56.64,18.92 55.75,19.81 52.45,19.81 51.82,20.45 v1(51.82,21.34) ; BTL2.5 50.85,8.05 51.69,8.89 51.69,17.91 49.02,20.57 v1(49.02,21.34) 49.02,22.22 48.56,22.68 46.56,22.68 46.3,22.43 43.87,22.43 43.56,22.73 v1(43.56,23.11) 43.56,24.77 41.4,26.92 37.85,26.92 37.72,26.8 v1(37.21,26.8) ; v1(43.56,21.34) 43.56,20.07 45.85,17.78 45.85,8.76 45.13,8.05 BTL3.5
LED-G2: length 30.7
  Top Layer w0.254: DRV.1 40.13,26.67 40.89,25.91 40.89,23.75 40.07,22.92 40.07,19.36 39.12,18.42 39.12,15.62 38.31,14.81 BTR1.5 BTR2.5 BTR3.5
LED-M1: length 48.6
  Top Layer w0.254: QM1.2 23.56,20 21.08,17.53 v1(21.08,16.89)
  Bottom Layer w0.254: BTL3.3 42.4,12.05 41.91,11.56 41.91,6.99 40.51,5.59 27.94,5.59 26.67,6.86 26.67,10.41 26.29,10.79 24.91,10.79 BTR3.3 24.84,10.86 22.42,10.86 21.08,12.19 v1(21.08,16.89)
LED-M2: length 45.3
  Top Layer w0.254: v1(32.38,6.73) 32.38,5.33 v1(32.77,4.95) ; v1(27.18,19.18) 27.18,20.89 27.88,21.59 QM2.2
  Bottom Layer w0.254: v1(32.38,6.73) 32.38,10.03 31.61,10.81 BTR2.3 28.43,10.81 27.18,12.06 v1(27.18,19.18) ; BTL2.3 47.74,12.05 46.86,11.18 46.86,5.72 46.1,4.95 v1(32.77,4.95)
LED-M3: length 63.6
  Top Layer w0.254: QM3.2 23.56,29.4 22.35,28.19 v1(22.35,22.61) ; v1(39.31,4.32) 38.73,4.89 v1(38.73,6.48)
  Bottom Layer w0.254: v1(39.31,4.32) 52.32,4.32 53.34,5.33 53.34,11.56 53.83,12.05 BTL1.3 ; v1(22.35,22.61) 22.35,20.7 23.11,19.94 32.51,19.94 33.27,19.18 33.27,12.06 34.53,10.81 BTR1.3 37.83,10.81 38.73,9.91 v1(38.73,6.48)
LED-R1: length 64.2
  Top Layer w0.254: v1(38.61,26.29) 38.86,26.03 DRV.15 ; v1(42.42,23.11) v1(42.42,22.1) ; v1(47.88,22.1) v1(50.67,22.1)
  Bottom Layer w0.254: BTL1.4 55.06,9.98 55.95,9.98 56.13,10.16 56.13,18.67 55.5,19.3 52.2,19.3 51.05,20.45 51.05,21.72 v1(50.67,22.1) ; v1(42.42,22.1) 42.42,20.32 45.34,17.4 45.34,10.29 45.1,10.05 BTL3.4 ; BTL2.4 50.69,10.05 51.05,10.41 51.05,17.53 47.88,20.7 v1(47.88,22.1) 46.74,22.1 46.56,21.92 43.61,21.92 v1(42.42,23.11) 42.42,25.15 41.15,26.42 38.73,26.42 v1(38.61,26.29)
LED-R2: length 45.1
  Top Layer w0.254: DRV.2 39.5,30.05 39.5,23.62 39.12,23.24 39.12,19.69 37.72,18.29 24.26,18.29 23.24,17.27 23.24,13.34 23.88,12.7 24.78,12.7 BTR3.4 BTR2.4 BTR1.4
OE: length 92.4
  Top Layer w0.254: v1(69.72,18.29) 69.72,17.78 70.16,17.34 QML.1 ; QMR.1 9.84,23.68 9.91,23.75 v1(10.29,23.75) ; MCU.21 v1(54.46,32.13) 58.93,32.13 61.59,29.46 v1(61.59,27.81)
  Bottom Layer w0.254: v1(61.59,27.81) 61.59,26.42 62.23,25.78 68.83,25.78 69.72,24.89 v1(69.72,18.29) ; v1(10.29,23.75) 10.29,27.05 12.19,28.96 44.83,28.96 47.24,31.37 47.24,36.83 48.13,37.72 49.78,37.72 50.04,37.97 53.59,37.97 54.48,37.08 54.48,34.72 53.97,34.21 53.97,32.62 v1(54.46,32.13)
OSC32_IN: length 8.1
  Top Layer w0.254: 49.09,39.6 48.09,39.6 48.04,39.55 47.5,39.55 47.32,39.73 47.32,40.31 46.41,41.22 45.77,41.22 X1.2 43.56,42.29 43.18,41.91 CX11.2
OSC32_OUT: length 8.1
  Top Layer w0.254: 49.09,39.1 48.09,39.1 48.04,39.14 47.33,39.14 46.91,39.56 46.91,40.08 46.19,40.81 45.77,40.81 X1.1 43.58,39.74 43.18,40.13 CX12.2
OSC_IN: length 12.6
  Top Layer w0.254: 49.09,38.6 48.09,38.6 48.04,38.55 46.82,38.55 45.55,37.28 45.55,36.06 45.38,35.89 44.75,35.89 44.38,35.51 44.12,35.51 43.94,35.69 X2.2 42.44,37.36 42.16,37.08 42.16,36.58 41.78,36.2 40.96,36.2
OSC_OUT: length 12.8
  Top Layer w0.254: 40.96,34.42 41.78,34.42 42.16,34.04 42.16,33.53 42.44,33.26 X2.1 43.81,33.38 43.81,34.92 43.99,35.1 44.54,35.1 44.92,35.48 45.59,35.48 45.95,35.85 45.95,37.11 46.99,38.14 47.91,38.14 47.96,38.1 49.09,38.1
RGB1: length 56.2
  Top Layer w0.254: MCU.19 53.46,34.79 v1(53.85,35.18) ; U1.2 12.32,26.42 v1(13.84,27.94)
  Bottom Layer w0.254: v1(53.85,35.18) 53.85,36.83 53.21,37.47 50.29,37.47 49.91,37.08 48.39,37.08 47.75,36.45 47.75,31.11 45.09,28.45 14.35,28.45 v1(13.84,27.94)
RGB1_5V: length 7.8
  Top Layer w0.254: U1.4 11.59,24.92 11.3,24.64 7.75,24.64 7.44,24.34 RSide.5
RGB2: length 41.6
  Top Layer w0.254: MCU.18 52.96,32.77 52.45,32.26 52.45,26.88 54.86,24.47 54.86,21.08 55.12,20.83 57.4,20.83 59.56,18.67 59.56,17.4 59.18,17.02 59.18,15.24 57.91,13.97 57.91,12.45 58.42,11.94 63.63,11.94 64.26,12.57 64.26,13.97 64.83,14.54 v1(65.91,14.54) ; U2.2 v1(69.22,14.61)
  Bottom Layer w0.254: v1(69.22,14.61) 65.98,14.61 v1(65.91,14.54)
RGB2_5V: length 8.5
  Top Layer w0.254: LSide.5 73.71,18.34 72.77,17.4 72.77,16.89 72.26,16.38 68.71,16.38 68.42,16.1 68.42,15.56
RGBEX: length 29.5
  Top Layer w0.254: UEX.2 59.56,11.18 59.31,11.43 58.29,11.43 57.4,12.32 57.4,14.22 58.67,15.49 58.67,17.14 59.06,17.53 59.06,18.54 57.28,20.32 54.99,20.32 54.36,20.95 54.36,24.26 51.96,26.65 MCU.16
RGBEX_5V: length 4.6
  Top Layer w0.254: UEX.4 61.88,13.11 62.36,13.59 LEDEX.2
ROW1: length 18.8
  Top Layer w0.254: DLM.1 45.97,49.02 46.35,48.64 v1(46.35,48.39) ; MCU.10 50.07,36.1 50.67,36.7 51.44,36.7 51.69,36.96 51.69,39.5 v1(51.05,40.13)
  Bottom Layer w0.254: v1(51.05,40.13) 51.05,42.42 47.88,45.59 46.99,45.59 46.35,46.23 v1(46.35,48.39)
ROW2: length 109.7
  Top Layer w0.254: D4.1 37.16,1.4 v1(37.44,1.12) ; MCU.11 50.2,35.6 50.8,36.2 v1(52.45,36.2) ; v1(43.76,29.72) 43.76,27.74 43.94,27.56 45.34,27.56 v1(48.13,24.77) 52.32,24.77 53.34,23.75 53.34,19.81 52.96,19.43 D1.1 51.87,18.24 53.77,16.33 v1(53.77,3.43) ; DRM.1 35.56,49.02 34.29,47.75 29.21,47.75 28.57,47.12 v1(28.57,46.36)
  Bottom Layer w0.254: v1(48.13,24.77) 48.13,26.29 52.45,30.61 v1(52.45,36.2) ; v1(43.76,29.72) 43.76,30.28 43.12,30.92 41.59,30.92 38.23,34.29 38.23,41.53 35.94,43.81 29.84,43.81 28.57,45.09 v1(28.57,46.36) ; v1(37.44,1.12) 51.92,1.12 53.77,2.97 v1(53.77,3.43)
ROW3: length 95.1
  Top Layer w0.254: MCU.12 50.34,35.1 50.85,35.61 v1(51.82,35.61) ; v1(48.31,3.43) 48.31,16.46 46.41,18.36 D2.1 46.41,23.29 47.24,24.13 v1(47.24,24.77) 44.96,27.05 43.56,27.05 42.8,27.81 v1(42.8,29.72) ; DSP1.1 28.4,47.83 27.69,47.12 v1(27.69,46.36) ; D5.1 31.75,3.38 31.75,2.03 v1(32,1.78)
  Bottom Layer w0.254: v1(27.69,46.36) 27.69,45.21 29.59,43.31 35.69,43.31 37.72,41.28 37.72,34.04 41.4,30.35 42.54,30.35 42.8,30.1 v1(42.8,29.72) ; v1(48.31,3.43) 48.31,2.84 47.24,1.78 v1(32,1.78) ; v1(47.24,24.77) 47.24,26.03 51.82,30.61 v1(51.82,35.61)
ROW4: length 102.4
  Top Layer w0.254: D6.1 26.24,2.67 v1(26.52,2.39) ; v1(51.18,35.03) 50.46,34.31 MCU.13 ; DSP2.1 19.89,48.18 20.32,47.75 26.16,47.75 26.8,47.12 v1(26.8,46.36) ; v1(42.85,3.43) 42.85,16.46 40.94,18.36 D3.1 40.94,22.66 42.04,23.75 46.1,23.75 46.35,24 v1(46.35,24.77) 44.58,26.54 43.05,26.54 41.78,27.81 v1(41.78,29.72)
  Bottom Layer w0.254: v1(42.85,3.43) 42.85,2.84 42.42,2.41 26.54,2.41 v1(26.52,2.39) ; v1(26.8,46.36) 26.8,45.34 29.34,42.8 35.43,42.8 37.21,41.02 37.21,33.78 41.28,29.72 v1(41.78,29.72) ; v1(46.35,24.77) 46.35,25.78 51.18,30.61 v1(51.18,35.03)
RST: length 21
  Top Layer w0.254: 47.3,32.95 46.61,32.26 46.61,31.62 46.03,31.04 41.6,31.04 40.77,31.87 40.77,32.38 40.39,32.77 38.99,32.77 37.39,34.37 37.39,36.65 ; MCU.7 47.76,37.6 47.37,37.21 CRST.2
RXD: length 12.4
  Top Layer w0.254: R1.2 66.36,37.91 v1(66.8,37.47) ; v1(66.8,30.35) 65.62,29.17 UUART.5
  Bottom Layer w0.254: v1(66.8,37.47) v1(66.8,30.35)
RXD_5V: length 7.9
  Top Layer w0.254: UART.2 61.32,25.38 61.98,26.03 65.37,26.03 65.62,26.29 UUART.8
SCL: length 39.5
  Top Layer w0.254: DRV.5 35.05,32 35.31,32.26 35.31,32.88 RSCL.1 35.31,34.54 34.67,35.18 34.67,37.08 33.76,38 33.76,45.76 35.65,47.65 47.92,47.65 51.22,44.35 52.64,44.35 53.42,43.57 53.42,43.15 53.46,43.1 MCU.42
SDA: length 39.4
  Top Layer w0.254: v1(33.4,36.96) 33.4,35.43 33.65,35.19 RSDA.1 33.65,32.14 33.78,32 DRV.6 ; MCU.43 52.96,43.1 53.01,43.15 53.01,43.4 52.47,43.94 51.05,43.94 47.75,47.24 47.37,47.24 47.19,47.06 47.19,46.66 47.01,46.48 46.86,46.48 46.68,46.66 46.68,47.06 46.5,47.24 35.81,47.24 34.16,45.59 34.16,39.88 34.67,39.37 v1(34.67,38.86)
  Bottom Layer w0.254: v1(33.4,36.96) 33.4,37.08 34.67,38.35 v1(34.67,38.86)
SPI_MISO: length 14.2
  Top Layer w0.254: R4.2 70.55,33.97 v1(72.39,35.81)
  Bottom Layer w0.254: v1(72.39,35.81) 72.39,37.34 73.77,38.72 SPI.3
SPI_MOSI: length 12
  Top Layer w0.254: SPI.4 72.15,36.72 70.55,35.12 R3.2
SPI_NSS: length 11.8
  Top Layer w0.254: SPI.6 71.51,32.72 70.48,31.69 R6.2
SPI_SCK: length 12.2
  Top Layer w0.254: R5.2 70.48,32.83 72.37,34.72 SPI.5
SWCLK: length 16.1
  Top Layer w0.254: SW.2 53.21,48.26 53.46,48.26 54.07,48.87 54.33,48.87 54.43,48.77 54.43,48.51 53.82,47.9 53.82,47.65 53.93,47.55 54.18,47.55 54.79,48.16 55.05,48.16 55.15,48.05 55.15,47.8 54.54,47.19 54.54,46.93 54.65,46.83 54.9,46.83 55.51,47.44 55.76,47.44 55.87,47.33 55.87,47.08 55.26,46.47 55.26,46.21 55.96,45.51 MCU.37
SWDIO: length 16.1
  Top Layer w0.254: SW.3 56.39,47.62 56.39,39.97 56.76,39.6 MCU.34
TXD: length 12.3
  Top Layer w0.254: UUART.4 68.72,29.58 v1(67.94,30.35) ; v1(67.94,36.32) 67.5,36.77 R2.2
  Bottom Layer w0.254: v1(67.94,36.32) v1(67.94,30.35)
TXD_5V: length 8
  Top Layer w0.254: UART.1 64.01,23.3 64.01,25.15 64.39,25.53 65.66,25.53 66.29,26.16 68.29,26.16 68.72,26.59 UUART.1
UARTOE: length 18.6
  Top Layer w0.254: v1(65.53,35.94) 61.21,35.94 60.06,37.1 MCU.29 ; UUART.6 64.89,28.2 64.52,28.58 RUART.2 64.13,28.95 v1(65.53,30.35)
  Bottom Layer w0.254: v1(65.53,35.94) 66.04,35.43 66.04,30.86 v1(65.53,30.35)
$1N8822: length 5.9
  Top Layer w0.254: 41.96,49.02 41.96,50.34 43.84,52.22 BTLM.1
$1N8852: length 5.9
  Top Layer w0.254: BTRM.1 35.45,52.22 33.58,50.34 DRM.2
$1N8879: length 5.9
  Top Layer w0.254: DSP1.2 25.2,50.29 27.07,52.17 BTTS.1
$1N30918: length 2.2
  Top Layer w0.254: DRV.8 30.69,30.69 30.48,30.48 30.48,30.1 30.23,29.84 I3.2
$1N30924: length 1.7
  Top Layer w0.254: I3.4 26.22,30.8 25.89,30.46 QM3.1
$1N31005: length 1.7
  Top Layer w0.254: QM1.1 25.89,26.65 26.22,26.98 I1.4
$1N31012: length 2.4
  Top Layer w0.254: I1.2 30.23,26.03 30.48,25.78 30.48,25.19 30.73,24.94 DRV.9
$1N31263: length 3.8
  Top Layer w0.254: QM2.1 30.37,22.84 30.66,22.55 30.66,20.78 30.89,20.54 I2.4
$1N31270: length 1.8
  Top Layer w0.254: DRV.10 32.51,23.14
$1N35496: length 4.1
  Top Layer w0.254: BTR1.1 33.96,4.96 D4.2
$1N35725: length 14.6
  Top Layer w0.254: RSide.2 6.14,18.34 7.24,19.43 7.24,22.1 7.87,22.73 QMR.2 10.16,22.73 10.47,23.05 14.41,23.05 14.85,23.49 RR.1
$1N35967: length 14.6
  Top Layer w0.254: QML.2 72.77,18.29 73.41,18.92 73.41,22.56 LSide.2 73.36,24.34 72.26,23.24 RL.1
$1N37620: length 4.6
  Top Layer w0.254: 55.07,19.43 54.36,19.43 54.1,19.18 54.1,16.94 BTL1.1
$1N37739: length 3.4
  Top Layer w0.254: BTL2.1 49.61,16.12 D2.2
$1N37949: length 3.4
  Top Layer w0.254: D3.2 44.14,16.12 BTL3.1
$1N38201: length 4.1
  Top Layer w0.254: BTR2.1 28.5,4.96 D5.2
$1N38293: length 4.1
  Top Layer w0.254: BTR3.1 23.04,4.96 D6.2
$1N38438: length 5.9
  Top Layer w0.254: BTSR.1 18.56,52.22 16.69,50.34 DSP2.2
$1N42496: length 1.8
  Top Layer w0.254: QMR.4 12.13,21.78 12.45,22.1 DRS.1
$1N42591: length 3.8
  Top Layer w0.254: DLS.1 70.94,20.4 69.78,19.24 68.42,19.24
$1N43093: length 11.3
  Top Layer w0.254: RBoot.2 46.83,44.7 38.35,44.7 37.34,45.72 37.34,46.24
$1N65972: length 5.6
  Top Layer w0.254: MCU.31 61.85,38.1 62.1,37.85 62.87,37.85 R1.1
$1N66002: length 5.8
  Top Layer w0.254: MCU.30 61.59,37.6 62.42,36.77 R2.1
$1N66032: length 6.1
  Top Layer w0.254: R3.1 61.28,35.12 59.8,36.6 MCU.28
$1N66062: length 6.4
  Top Layer w0.254: R4.1 61.66,33.97 59.53,36.1 MCU.27
$1N66092: length 6.6
  Top Layer w0.254: MCU.26 59.27,35.6 62.04,32.83 R5.1
$1N66122: length 6.9
  Top Layer w0.254: MCU.25 59.01,35.1 62.42,31.69 R6.1

## Copper pours and planes (outline as drawn; the poured copper is in the pictures)
GND on Top Layer: -0.13,60 79.87,60 79.87,0 -0.13,0
GND on Bottom Layer: -0.13,60 79.87,60 79.87,0 -0.13,0

Small or netless copper shapes (teardrops, artwork), in the pictures only: 349 on Top Layer, 124 on Bottom Layer

## Text on the board
Bottom Silkscreen Layer: 20250418 | sim.bysb.net | SimDevices©2018-2025 | SimGeki Core | v4.4 | CORE-BRD | BACK | 94-V0 | E123995 | 2501-001
Top Solder Mask Layer: Core | SimGeki
Top Silkscreen Layer: CH32 / V203C8T6 | V33 / ADC / GND | 5VIN | SWDIO | SWCLK | GND | V33 / GND / MISO / MOSI / SCK / SCS | G / Act / 5V | G / Dat / 5V | 5V | Dat | G | Act | D+ | D- | DAT | RX | TX | FRONT
